# Altium schematic sheet IR.SchDoc
size A4
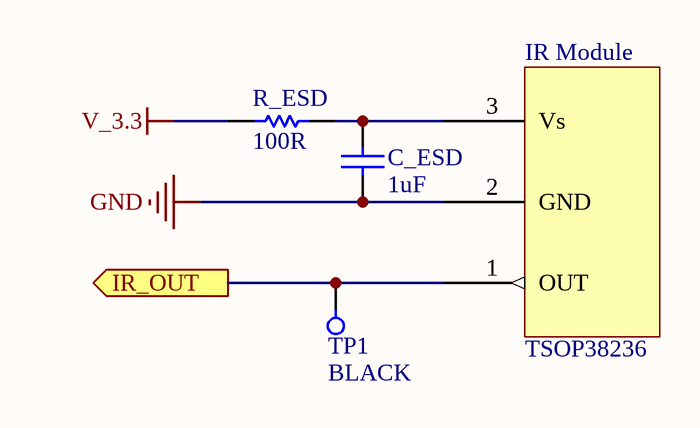
[diagram p0: IR.SchDoc]

## Parts
C_ESD  1uF  [0603]
IR_Module  TSOP38236  [TSOP38236 IR Receiver]
R_ESD  100R  [0603]
TP1  BLACK  [testpoint-small]

## Ports
IR_OUT (out)

## Nets
GND: C_ESD.1 IR_Module.2(GND)
V_3.3: R_ESD.1
IR_OUT: IR_Module.1(OUT) TP1.1 ; port IR_OUT
NetC_ESD_2: C_ESD.2 IR_Module.3(Vs) R_ESD.2

## Library data of the parts
C_ESD = CP_1uF_50V_0603: CAP CER 1.0UF 50V X7R 0603; Manufacturer: Taiyo Yuden; Manufacturer PN: UMK107C5105KA-T; Supplier_Component_Code: 445-5090-2-ND; Supplier_Name: Digikey; Supplier 1: Digi-Key; Supplier Part Number 1: 445-5090-2-ND; Value: 1uF
R_ESD = RS_100R 0603: RES 100 OHM 1/10W 1% 0603 SMD; Manufacturer: ROHM; Manufacturer PN: MCR03EZPFX1000; LatestRevisionDate: n/a; Supplier_Name: Digikey; Supplier 1: Digi-Key; Supplier Part Number 1: RHM100HTR-ND; Value: 100R
TP1 = TP5001: TEST POINT PC MINI .040"D BLACK; ECE_Component_Code: TP5001; Supplier_Component_Code: 5001K-ND; published: 12/06/2007; Supplier_Name: Digikey; price: 0.3; value: BLACK; Part Number: TP5001; Component Kind: Standard; Component Type: Standard; Designator: TP5001; Pin Count: 1